# EasyEDA schematic omicronHandMotion.json
TITLE: Sheet_1; REV: 1.0; Date: 2022-07-14; Sheet: 1/1; Company: Your Company
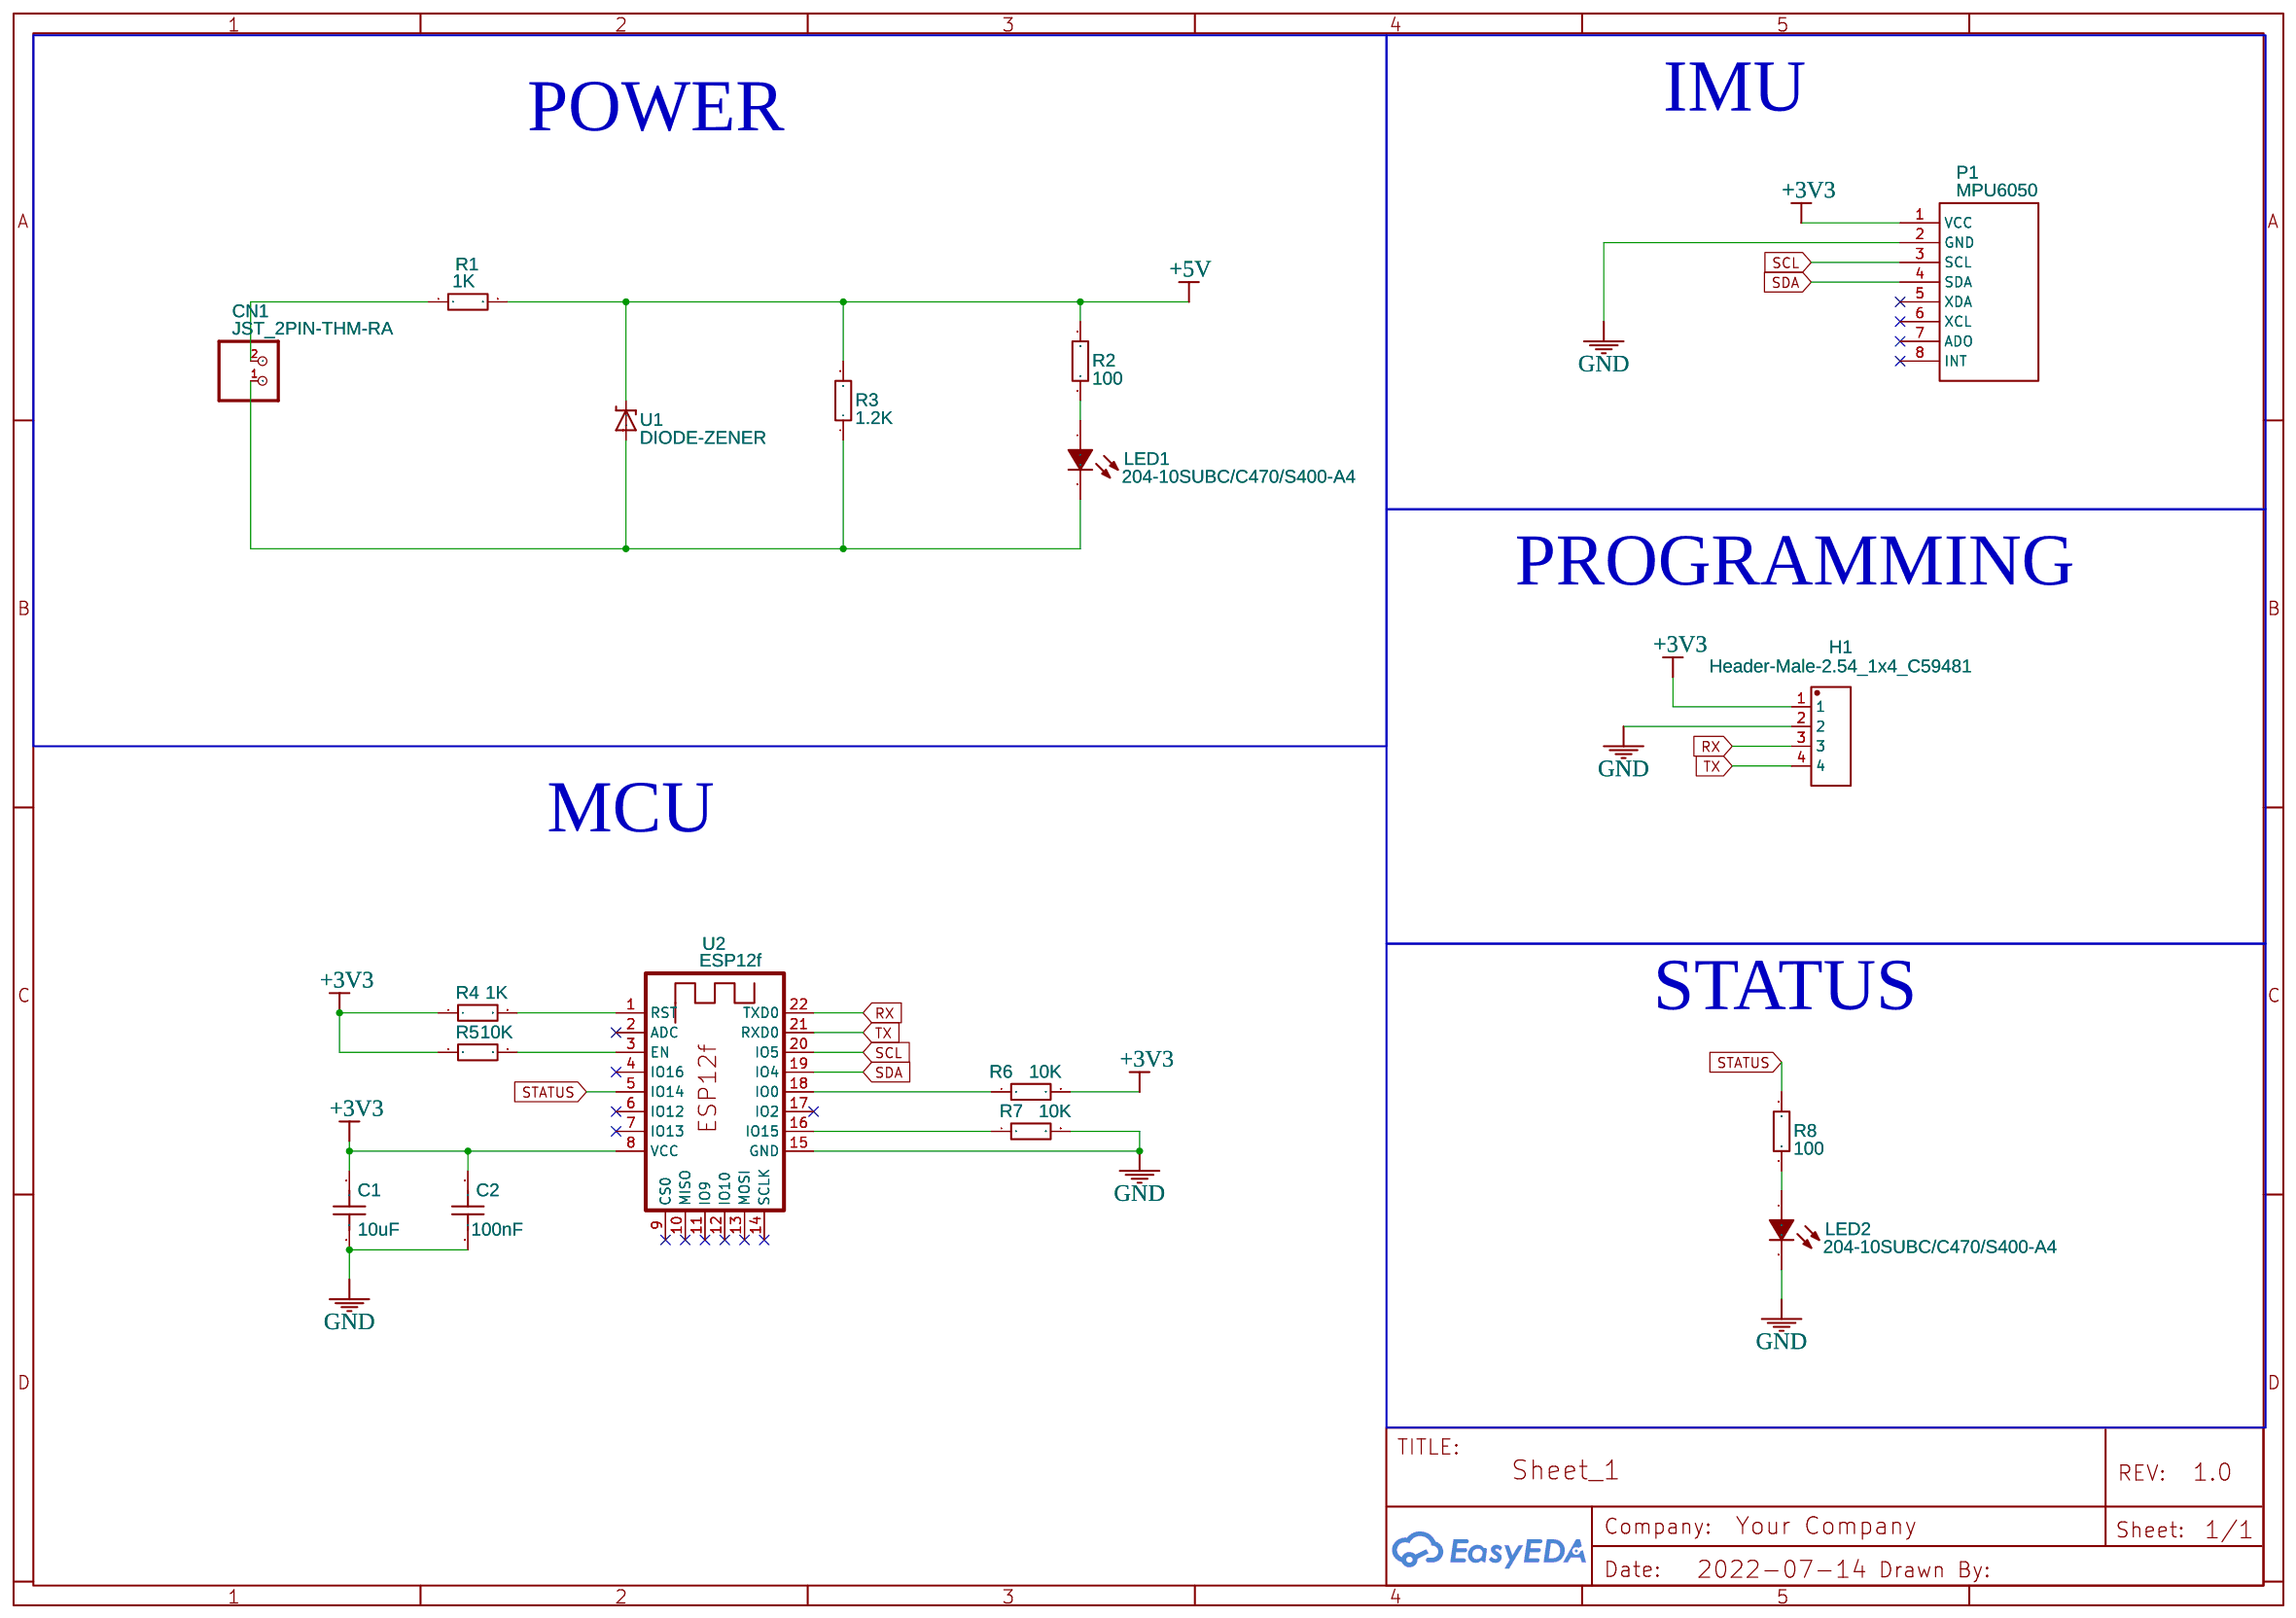
[diagram p0: schematic sheet]

## Parts
C1  10uF  [CAP-TH_L5.0-W2.5-P5.08-D0.7]
C2  100nF  [CAP-TH_L5.0-W2.5-P5.08-D0.7]
CN1  JST_2PIN-THM-RA  [JST-PH-2-THM-RA]
H1  Header-Male-2.54_1x4_C59481  [HDR-TH_4P-P2.54-V]
LED1  204-10SUBC/C470/S400-A4  [LED-TH_BD4.0-P2.54-FD]
LED2  204-10SUBC/C470/S400-A4  [LED-TH_BD4.0-P2.54-FD]
P1  MPU6050  [MPU6050]
R1  1K  [RES-TH_BD2.2-L6.5-P10.50-D0.6]
R2  100  [RES-TH_BD2.2-L6.5-P10.50-D0.6]
R3  1.2K  [RES-TH_BD2.2-L6.5-P10.50-D0.6]
R4  1K  [RES-TH_BD2.2-L6.5-P10.50-D0.6]
R5  10K  [RES-TH_BD2.2-L6.5-P10.50-D0.6]
R6  10K  [RES-TH_BD2.2-L6.5-P10.50-D0.6]
R7  10K  [RES-TH_BD2.2-L6.5-P10.50-D0.6]
R8  100  [RES-TH_BD2.2-L6.5-P10.50-D0.6]
U1  DIODE-ZENER  [DIODE-ZENER]
U2  ESP12f  [ESP12F]

## Library data of the parts
C1 C2 = CC1H104ZC14D3F5O10MF: Supplier: LCSC; Supplier Part: C254090; Manufacturer: Dersonic; Contributor: LCSC; JLCPCB Part Class: Extended Part
CN1 = JST_2PIN-THM-RA: Contributor: Vicente Franco Bayona
H1 = Header-Male-2.54_1x4_C59481: Supplier: LCSC; Manufacturer: ReliaPro; Manufacturer Part: Headers  Pins 1*4P; Supplier Part: C59481
LED1 LED2 = 204-10SUBC/C470/S400-A4: Supplier: LCSC; Supplier Part: C86726; Manufacturer: Everlight Elec; Contributor: LCSC; JLCPCB Part Class: Extended Part
P1 = MPU6050: sourceId: 1T5FDZYC8; Contributor: Marcus9812
R1-R8 = MF1/4W-1Ω±1% T52: Supplier: LCSC; Supplier Part: C119263; Manufacturer: Chian Chia Elec; Contributor: LCSC; JLCPCB Part Class: Extended Part; Resistance: 1Ω
U1 = DIODE-ZENER: Contributor: SparkFun
U2 = ESP12f: Contributor: emilmirza70

## Nets
+3V3: C1.2 C2.2 H1.1 P1.1(VCC) R4.1 R5.1 R6.2 U2.8(VCC)
+5V: R1.2 R2.2 R3.2 U1.P$1(C)
GND: C1.1 C2.1 H1.2 LED2.2(C) P1.2(GND) R7.2 U2.15(GND)
RX: H1.3 U2.22(TXD0)
SCL: P1.3(SCL) U2.20(IO5)
SDA: P1.4(SDA) U2.19(IO4)
STATUS: R8.2 U2.5(IO14)
TX: H1.4 U2.21(RXD0)
Net-(CN1-1): CN1.1(2) LED1.2(C) R3.1 U1.P$2(A)
Net-(CN1-2): CN1.2(1) R1.1
Net-(LED1-1): LED1.1(A) R2.1
Net-(LED2-1): LED2.1(A) R8.1
Net-(R4-2): R4.2 U2.1(RST)
Net-(R5-2): R5.2 U2.3(EN)
Net-(R6-1): R6.1 U2.18(IO0)
Net-(R7-1): R7.1 U2.16(IO15)

Not connected (* = marked no-connect by the designer): P1 5(XDA)* 6(XCL)* 7(ADO)* 8(INT)*; U2 2(ADC)* 4(IO16)* 6(IO12)* 7(IO13)* 9(CS0)* 10(MISO)* 11(IO9)* 12(IO10)* 13(MOSI)* 14(SCLK)* 17(IO2)*

## Notes on the sheet
- IMU
- POWER
- PROGRAMMING
- MCU
- STATUS
